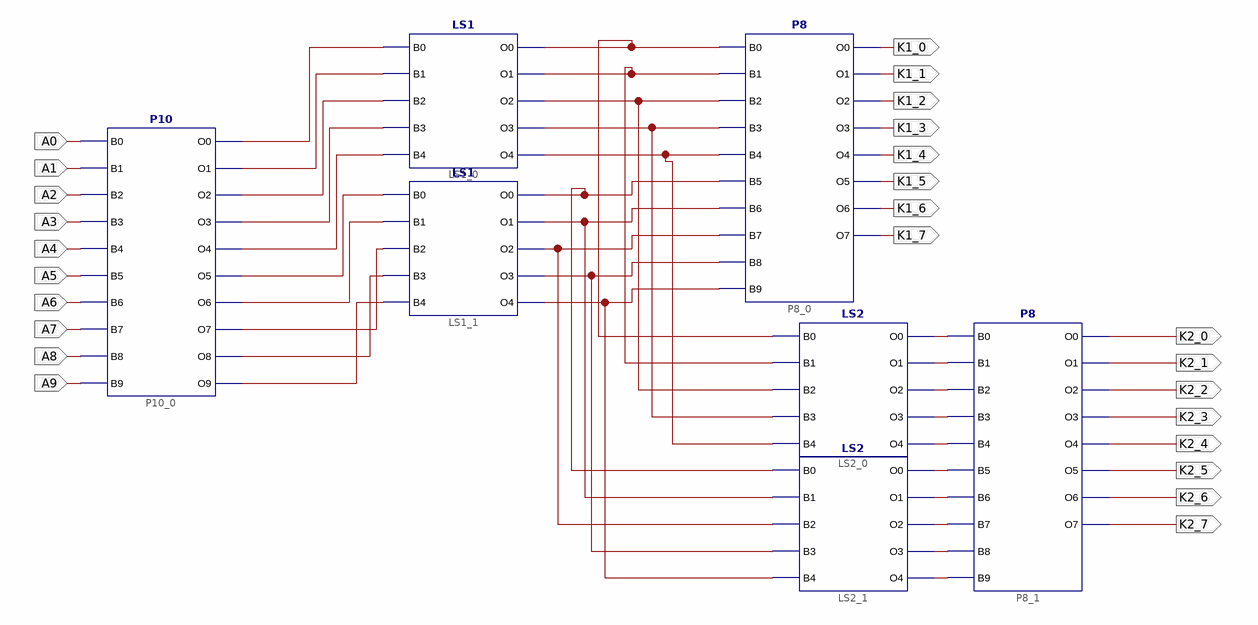
[diagram p0: schematic sheet 1]
// Xilinx ISE schematic Key.sch (xc9500xl) as structural Verilog: 7 symbols, 26 ports
module Key (
  input  A0,
  input  A1,
  input  A2,
  input  A3,
  input  A4,
  input  A5,
  input  A6,
  input  A7,
  input  A8,
  input  A9,
  output K1_0,
  output K1_1,
  output K1_2,
  output K1_3,
  output K1_4,
  output K1_5,
  output K1_6,
  output K1_7,
  output K2_0,
  output K2_1,
  output K2_2,
  output K2_3,
  output K2_4,
  output K2_5,
  output K2_6,
  output K2_7
);

  wire XLXN_27, XLXN_32, XLXN_33, XLXN_34, XLXN_35, XLXN_36, XLXN_37, XLXN_38, XLXN_39, XLXN_40, XLXN_51,
       XLXN_52, XLXN_53, XLXN_56, XLXN_81, XLXN_82, XLXN_83, XLXN_84, XLXN_85, XLXN_86, XLXN_87, XLXN_88,
       XLXN_89, XLXN_90, XLXN_92, XLXN_94, XLXN_96, XLXN_97, XLXN_98, XLXN_99;

  P10 P10_0 (
    .B0(A0), .B1(A1), .B2(A2), .B3(A3), .B4(A4), .B5(A5), .B6(A6), .B7(A7), .B8(A8), .B9(A9), .O0(XLXN_27),
    .O1(XLXN_32), .O2(XLXN_33), .O3(XLXN_34), .O4(XLXN_35), .O5(XLXN_36), .O6(XLXN_37), .O7(XLXN_38),
    .O8(XLXN_39), .O9(XLXN_40));
  LS1 LS1_0 (
    .B0(XLXN_27), .B1(XLXN_32), .B2(XLXN_33), .B3(XLXN_34), .B4(XLXN_35), .O0(XLXN_51), .O1(XLXN_52),
    .O2(XLXN_53), .O3(XLXN_92), .O4(XLXN_94));
  LS1 LS1_1 (
    .B0(XLXN_36), .B1(XLXN_37), .B2(XLXN_38), .B3(XLXN_39), .B4(XLXN_40), .O0(XLXN_56), .O1(XLXN_96),
    .O2(XLXN_97), .O3(XLXN_98), .O4(XLXN_99));
  P8 P8_0 (
    .B0(XLXN_51), .B1(XLXN_52), .B2(XLXN_53), .B3(XLXN_92), .B4(XLXN_94), .B5(XLXN_56), .B6(XLXN_96),
    .B7(XLXN_97), .B8(XLXN_98), .B9(XLXN_99), .O0(K1_0), .O1(K1_1), .O2(K1_2), .O3(K1_3), .O4(K1_4),
    .O5(K1_5), .O6(K1_6), .O7(K1_7));
  P8 P8_1 (
    .B0(XLXN_81), .B1(XLXN_82), .B2(XLXN_83), .B3(XLXN_84), .B4(XLXN_85), .B5(XLXN_86), .B6(XLXN_87),
    .B7(XLXN_88), .B8(XLXN_89), .B9(XLXN_90), .O0(K2_0), .O1(K2_1), .O2(K2_2), .O3(K2_3), .O4(K2_4),
    .O5(K2_5), .O6(K2_6), .O7(K2_7));
  LS2 LS2_0 (
    .B0(XLXN_51), .B1(XLXN_52), .B2(XLXN_53), .B3(XLXN_92), .B4(XLXN_94), .O0(XLXN_81), .O1(XLXN_82),
    .O2(XLXN_83), .O3(XLXN_84), .O4(XLXN_85));
  LS2 LS2_1 (
    .B0(XLXN_56), .B1(XLXN_96), .B2(XLXN_97), .B3(XLXN_98), .B4(XLXN_99), .O0(XLXN_86), .O1(XLXN_87),
    .O2(XLXN_88), .O3(XLXN_89), .O4(XLXN_90));
endmodule
